# EAGLE design PCBFeeder_A_Board (EAGLE 8.4.3)
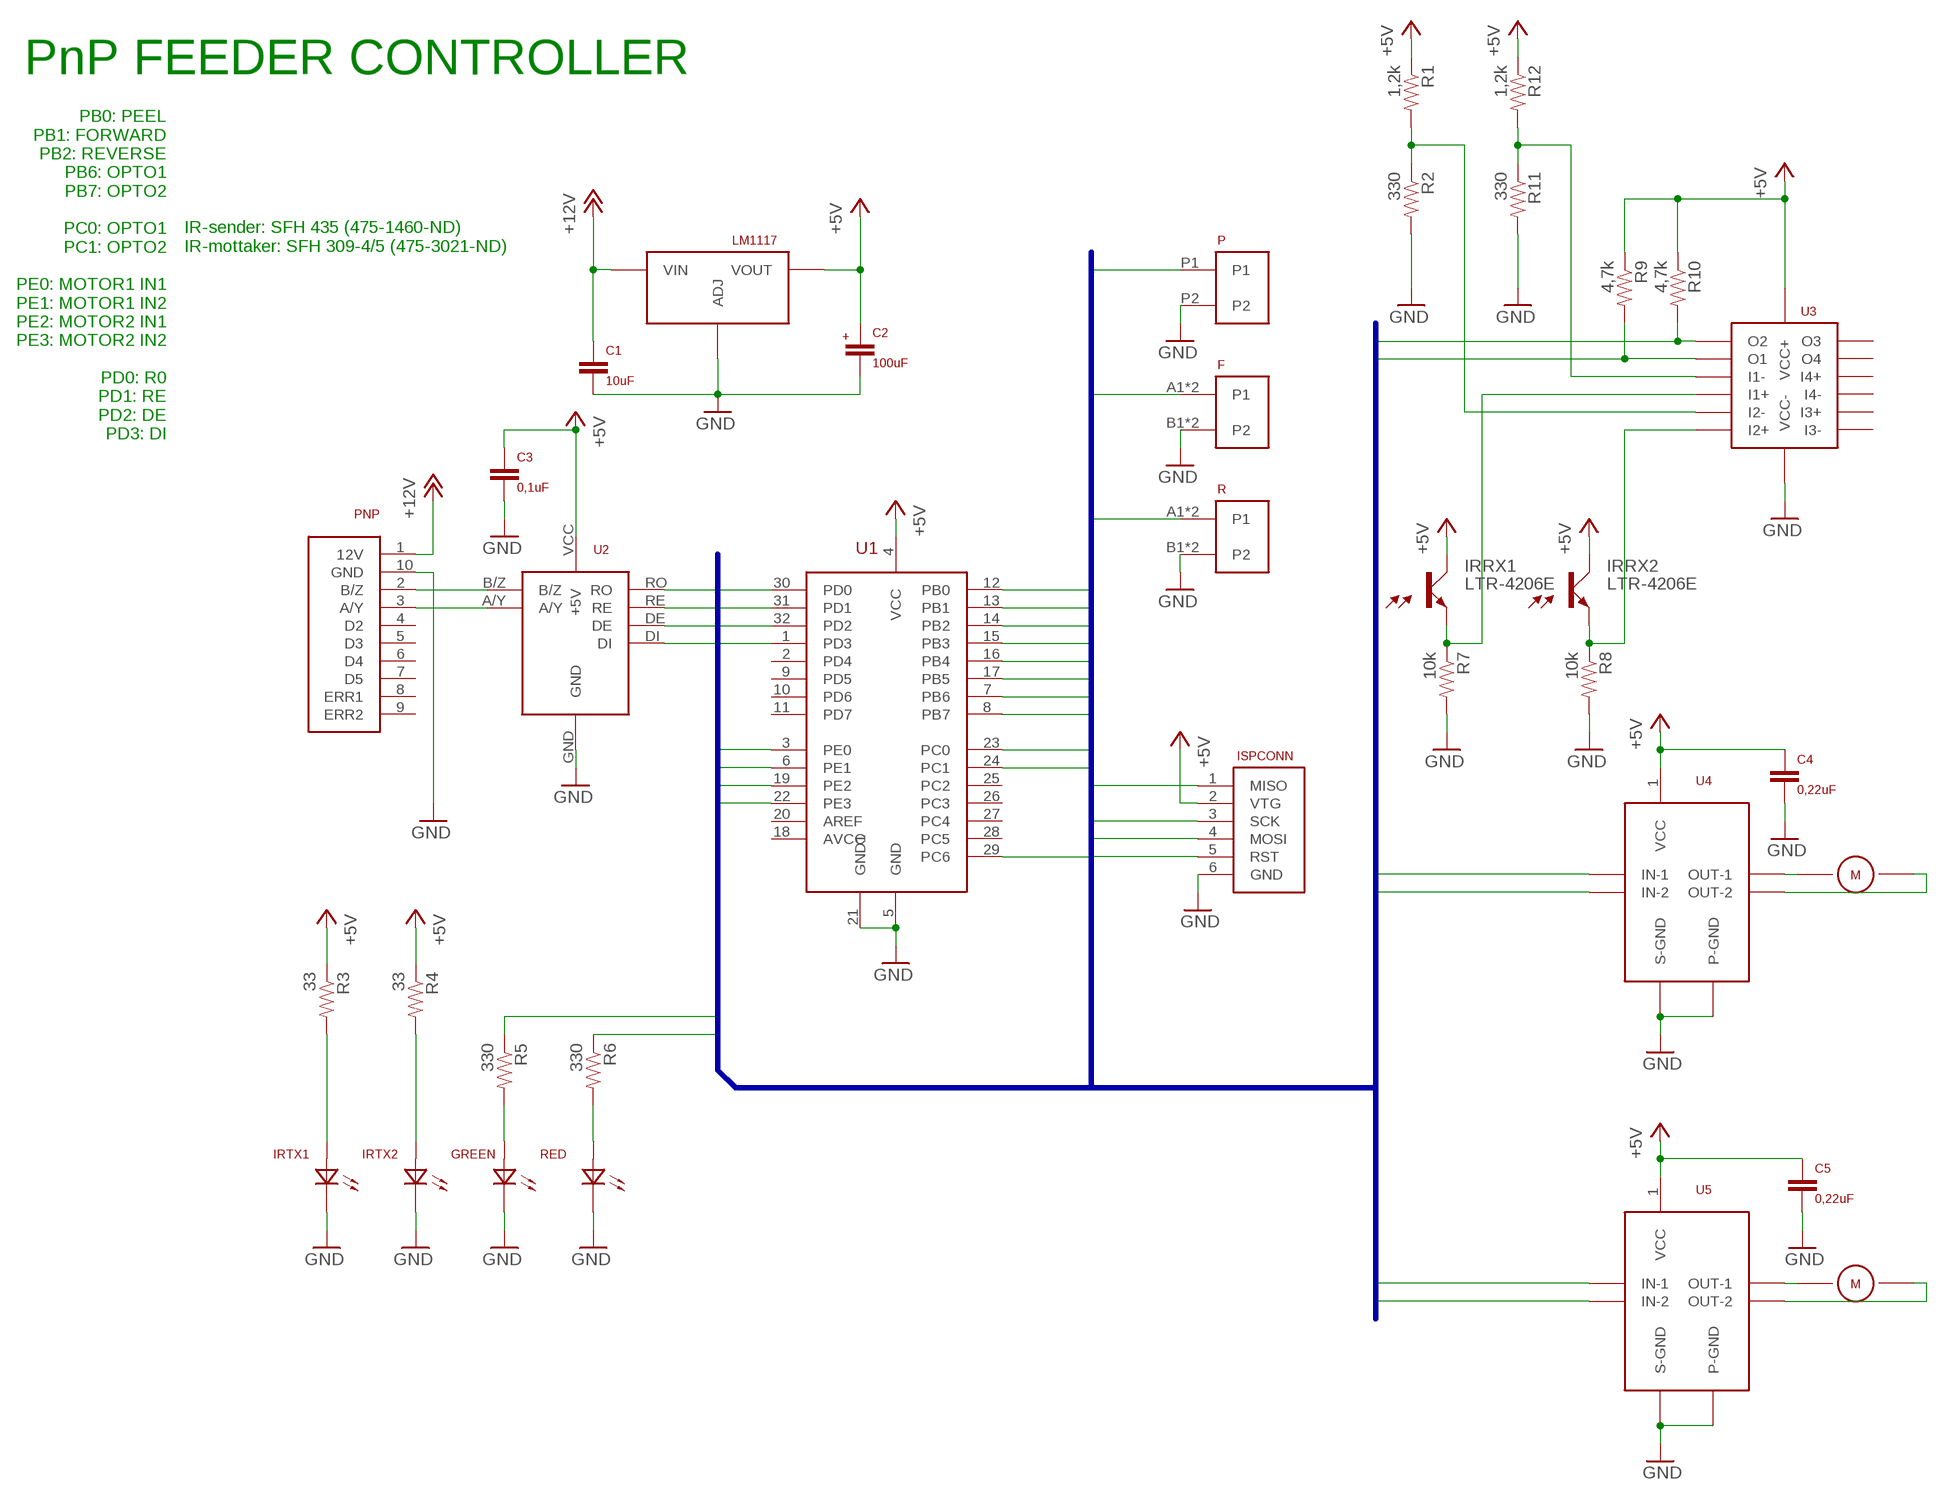
[diagram p0: schematic, sheet 1]

## Parts
C1  10uF  0.1UF-08050805  [0805]
C2  100uF  ELECTROLYTIC_CAPACITORWURTH_100  [ALUMINUM_WURTH_100UF_865080243007]
C3  0,1uF  0.1UF-08050805  [0805]
C4  0,22uF  0.22UF-08050805  [0805]
C5  0,22uF  0.22UF-08050805  [0805]
F  TERMINAL_2PSIDE_SWITCH  [SIDE-PUSH-SWITCH]
GREEN  LED  [LED_859_KTST_S220KSKT]
IRRX1  LTR-4206E  [DIODE_BREAKOUT]
IRRX2  LTR-4206E  [DIODE_BREAKOUT]
IRTX1  IR204C_IR_EMITTER  [IR_EMITTER_475-3009-1-ND]
IRTX2  IR204C_IR_EMITTER  [IR_EMITTER_475-3009-1-ND]
ISPCONN  ISP_PROG_HEADER  [IDC_HEADER_6P]
LM1117  LM1117  [SOT-223]
M1  MOTOR254  [SOLDER_CONNECTOR_2P_254]
M2  MOTOR254  [SOLDER_CONNECTOR_2P_254]
P  TERMINAL_2P254  [SOLDER_CONNECTOR_2P_254]
PNP  FEEDER_HEADER  [IDC_HEADER_VERTICAL_10P]
R  TERMINAL_2PSIDE_SWITCH  [SIDE-PUSH-SWITCH]
R1  1,2k  RESISTOR0805  [0805]
R2  330  RESISTOR0805  [0805]
R3  33  RESISTOR0805  [0805]
R4  33  RESISTOR0805  [0805]
R5  330  RESISTOR0805  [0805]
R6  330  RESISTOR0805  [0805]
R7  10k  RESISTOR0805  [0805]
R8  10k  RESISTOR0805  [0805]
R9  4,7k  RESISTOR0805  [0805]
R10  4,7k  RESISTOR0805  [0805]
R11  330  RESISTOR0805  [0805]
R12  1,2k  RESISTOR0805  [0805]
RED  LED  [LED_859_KTST_S220KSKT]
U1  MEGA168-AI  [TQFP32-08]
U2  ISL81487  ISL81487_RS485_TRANSCIEVER  [ISL81487_RS485_TRANSCIEVER]
U3  LM339  [TSSOP14]
U4  LB1930MC-AH-MOTOR-DRIVER  [SOIC-10]
U5  LB1930MC-AH-MOTOR-DRIVER  [SOIC-10]

## Nets
+5V: C2.+ C3.1 C4.1 C5.1 IRRX1.A IRRX2.A ISPCONN.2(VTG) LM1117.VOUT$1(VOUT) R1.1 R3.1 R4.1 R9.1 R10.1 R12.1 U1.4(VCC) U2.VCC(+5V) U3.P3(VCC+) U4.1(VCC) U5.1(VCC)
+12V: C1.1 LM1117.VIN PNP.1(12V)
DE: U1.32(PD2) U2.DE
DI: U1.1(PD3) U2.DI
FORWARD: F.A1(P1) F.A2(P1) U1.13(PB1)
GND: C1.2 C2.- C3.2 C4.2 C5.2 F.B1(P2) F.B2(P2) GREEN.C IRTX1.C IRTX2.C ISPCONN.6(GND) LM1117.GND(ADJ) P.P2 PNP.10(GND) R2.2 R7.2 R8.2 R11.2 R.B1(P2) R.B2(P2) RED.C U1.5(GND) U1.21(GND1) U2.GND U3.P12(VCC-) U4.5(S-GND) U4.6(P-GND) U5.5(S-GND) U5.6(P-GND)
LED_G: R5.1 U1.24(PC1)
LED_R: R6.1 U1.23(PC0)
M1_IN1: U1.3(PE0) U4.3(IN-1)
M1_IN2: U1.6(PE1) U4.4(IN-2)
M2_IN1: U1.19(PE2) U5.3(IN-1)
M2_IN2: U1.22(PE3) U5.4(IN-2)
MISO: ISPCONN.1(MISO) U1.16(PB4)
MOSI: ISPCONN.4(MOSI) U1.15(PB3)
N$1: PNP.2(B/Z) U2.B/Z
N$2: PNP.3(A/Y) U2.A/Y
N$3: IRRX1.C R7.1 U3.P5(I1+)
N$4: IRRX2.C R8.1 U3.P7(I2+)
N$5: R1.2 R2.1 U3.P6(I2-)
N$6: R11.1 R12.2 U3.P4(I1-)
N$11: M1.P1(A) U4.9(OUT-1)
N$12: M1.P2(B) U4.7(OUT-2)
N$13: M2.P1(A) U5.9(OUT-1)
N$14: M2.P2(B) U5.7(OUT-2)
N$15: IRTX1.A R3.2
N$16: IRTX2.A R4.2
N$17: GREEN.A R5.2
N$18: R6.2 RED.A
OPTO1: R9.2 U1.7(PB6) U3.P2(O1)
OPTO2: R10.2 U1.8(PB7) U3.P1(O2)
PEEL: P.P1 U1.12(PB0)
RE: U1.31(PD1) U2.RE
REVERSE: R.A1(P1) R.A2(P1) U1.14(PB2)
RO: U1.30(PD0) U2.RO
RST: ISPCONN.5(RST) U1.29(PC6)
SCK: ISPCONN.3(SCK) U1.17(PB5)
Unconnected: PNP.4(D2) PNP.5(D3) PNP.6(D4) PNP.7(D5) PNP.8(ERR1) PNP.9(ERR2) U1.2(PD4) U1.9(PD5) U1.10(PD6) U1.11(PD7) U1.18(AVCC) U1.20(AREF) U1.25(PC2) U1.26(PC3) U1.27(PC4) U1.28(PC5) U3.P8(I3-) U3.P9(I3+) U3.P10(I4-) U3.P11(I4+) U3.P13(O4) U3.P14(O3)

## Buses
RO,RE,DE,DI,MISO,SCK,MOSI,RST,PEEL,FORWARD,REVERSE,OPTO1,OPTO2,LED_R,LED_G,M1_IN1,M1_IN2,M2_IN1,M2_IN2

## Notes on the sheet
- PnP FEEDER CONTROLLER
- PB0: PEEL
  PB1: FORWARD
  PB2: REVERSE
  PB6: OPTO1
  PB7: OPTO2
  
  PC0: OPTO1
  PC1: OPTO2
  
  PE0: MOTOR1 IN1
  PE1: MOTOR1 IN2
  PE2: MOTOR2 IN1
  PE3: MOTOR2 IN2
  
  PD0: R0
  PD1: RE
  PD2: DE
  PD3: DI
- IR-sender: SFH 435 (475-1460-ND)
  IR-mottaker: SFH 309-4/5 (475-3021-ND)

## Library data of the parts
C1 = EE:0.1UF-0805; VALUE: 0,1uF
C2 = EE:ELECTROLYTIC_CAPACITOR
C3 = EE:0.1UF-0805
C4 C5 = EE:0.22UF-0805
F P R = EE:TERMINAL_2P
GREEN RED = EE:LED: LED-Anzeigeleuchte
IRRX1 IRRX2 = EE:LTR-4206E: Silicium NPN Phototransistor Source: Siemens; OC_FARNELL: unknown; OC_NEWARK: unknown
IRTX1 IRTX2 = EE:IR204C_IR_EMITTER
ISPCONN = EE:ISP_PROG_HEADER
LM1117 = EE:LM1117
M1 M2 = EE:MOTOR
PNP = EE:FEEDER_HEADER
R1-R12 = EE:RESISTOR
U1 = EE:MEGA168: MICROCONTROLLER 8 Kbytes FLASH, 1 kbytes SRAM, 512 bytes EEPROM, USART, 6-channel 10 bit ADC, 2-channel 8 bit ADC Pin compatible with Atmega48, ATMega88, ATMega168 Source: avr.lbr; MPN: ATMEGA8-16AU; OC_FARNELL: 9171371; OC_NEWARK: 73M8863
U2 = EE:ISL81487_RS485_TRANSCIEVER
U3 = EE:LM339
U4 U5 = EE:LB1930MC-AH-MOTOR-DRIVER

## Board
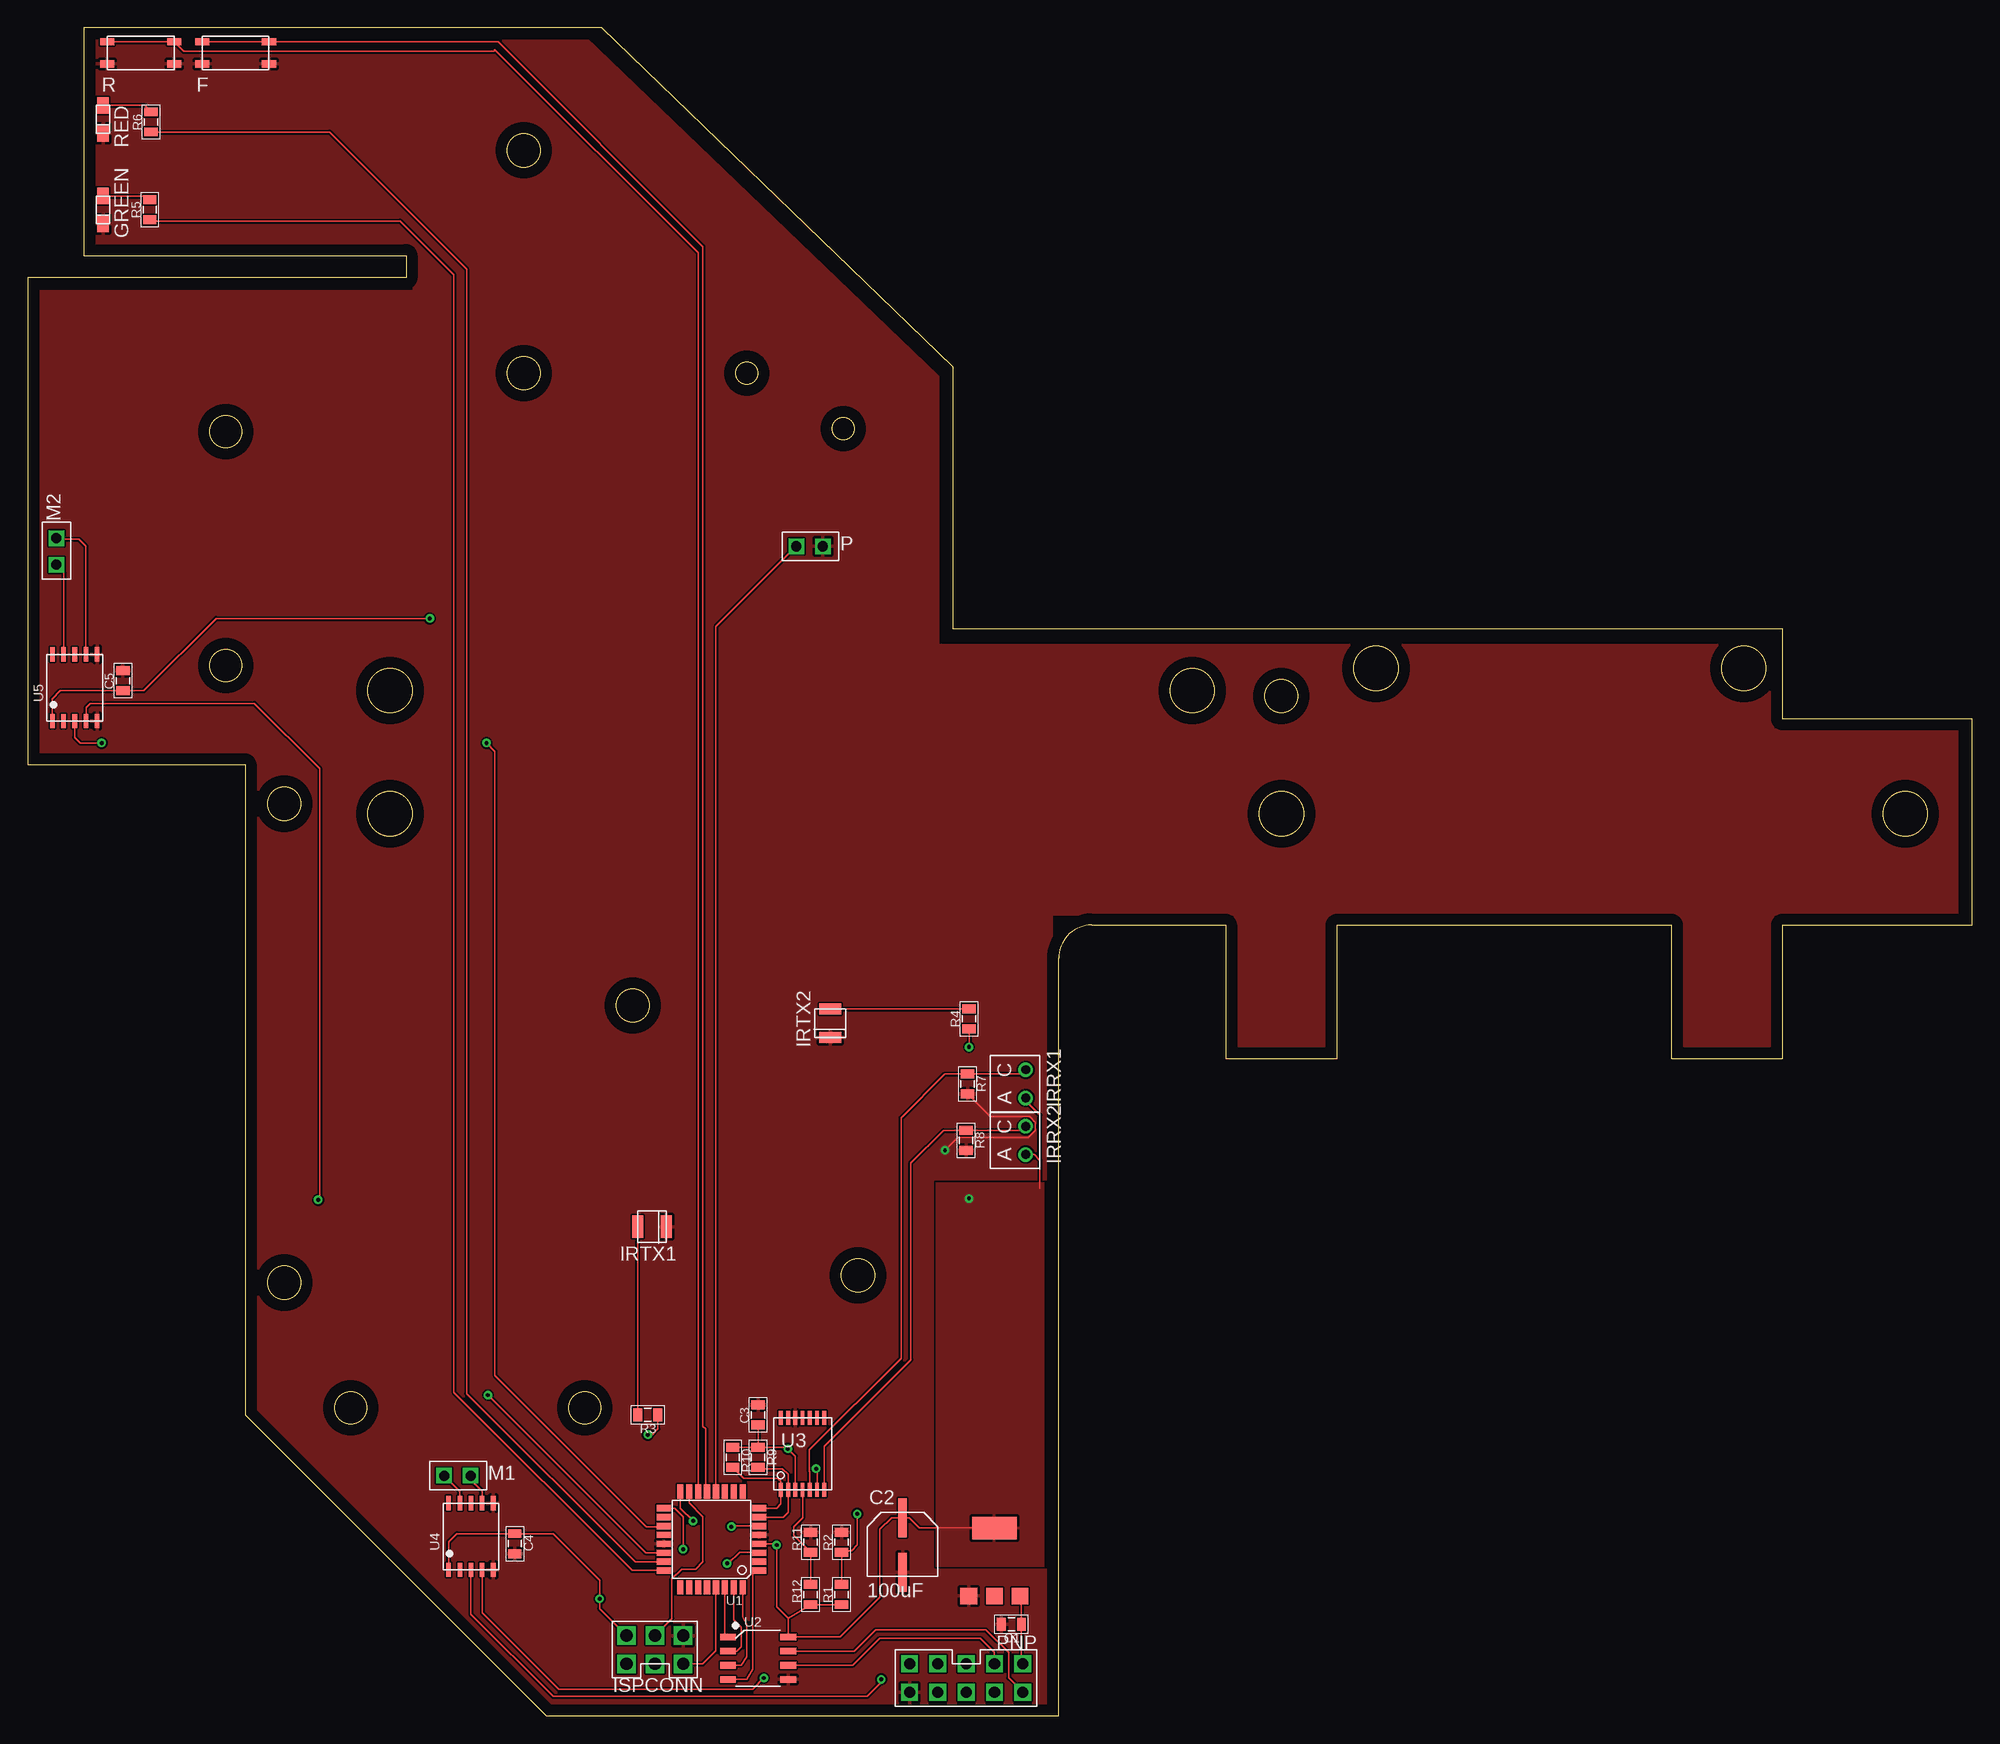
[diagram p1: board, top side]
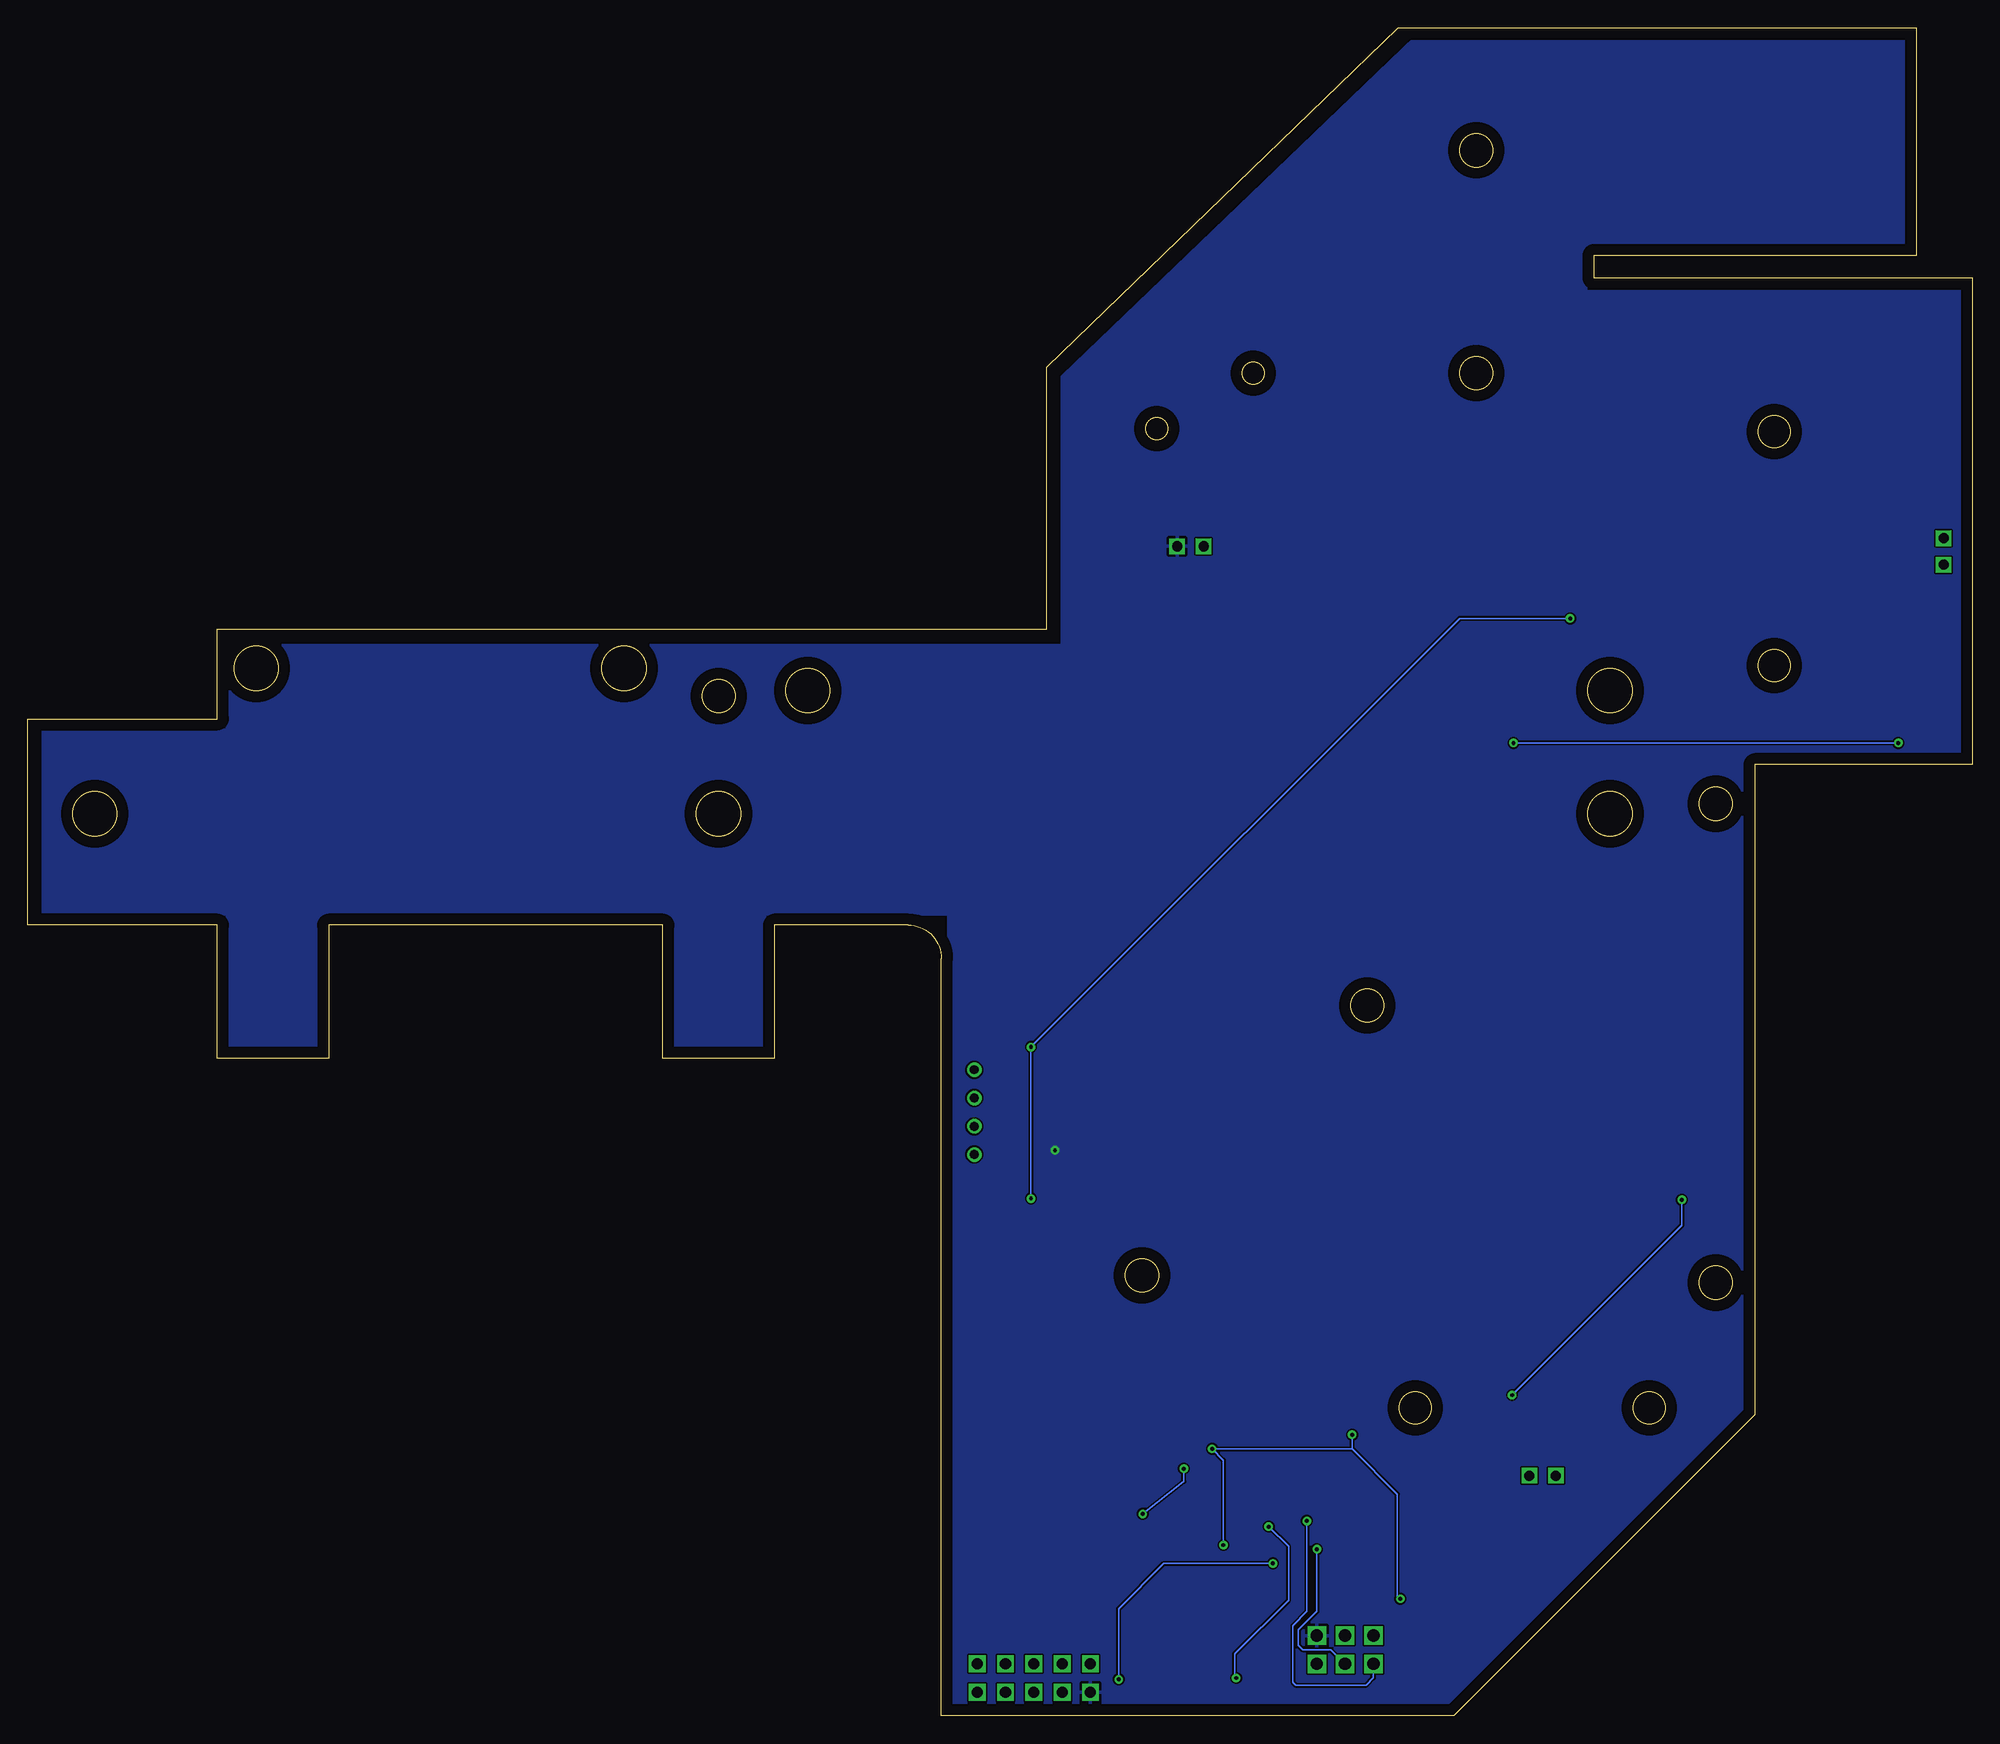
[diagram p2: board, bottom side, seen from below]

Size 174.51 x 151.55 mm. Coordinates in mm from the lower left corner, seen from the top.
Outline: 157.51,71 174.51,71 174.51,89.5 157.51,89.5 157.51,97.55 83.05,97.55 83.05,121.08 51.51,151.55 5,151.55 5,131.1 33.96,131.1 33.96,129.1 0,129.1 0,85.39 19.51,85.39 19.51,27 46.51,0 92.51,0 92.51,68 arc-90 95.51,71 107.51,71 107.51,59 117.51,59 117.51,71 147.51,71 147.51,59 157.51,59 157.51,71
Outline: circle at 168.51,81 radius 2
Outline: circle at 17.75,115.3 radius 1.45
Outline: circle at 17.75,94.3 radius 1.45
Outline: circle at 44.51,140.55 radius 1.5
Outline: circle at 44.51,120.55 radius 1.5
Outline: circle at 54.29,63.79 radius 1.5
Outline: circle at 74.51,39.55 radius 1.5
Outline: circle at 23.01,38.89 radius 1.5
Outline: circle at 23.01,81.89 radius 1.5
Outline: circle at 64.51,120.55 radius 1
Outline: circle at 73.18,115.57 radius 1
Outline: circle at 112.51,91.55 radius 1.5
Outline: circle at 29,27.65 radius 1.45
Outline: circle at 50,27.65 radius 1.45
Outline: circle at 121.01,94.05 radius 2
Outline: circle at 154.01,94.05 radius 2
Outline: circle at 112.51,81 radius 2
Outline: circle at 32.51,81 radius 2
Outline: circle at 104.51,92.05 radius 2
Outline: circle at 32.51,92.05 radius 2
Copper layers (1*16): Top 0.035mm / dielectric 1.5mm / Bottom 0.035mm
Design rules "default": minimum track width 6mil, minimum drill 0.35mm, track to track 6mil, track to pad 6mil, pad to pad 6mil, via to via 6mil, smd to smd 6mil, copper to edge 40mil, drill to drill 6mil, minimum pad ring 10mil, minimum via ring 8mil, stop-mask expansion 4mil, vias tented up to drill 0mil, thermal gap 10mil

### Footprints (pad centres in the part's own frame; a part is rotated, then mirrored left to right if it is on the bottom)
0805 = smd 0.8 x 1.2: 1 -0.9,0; 2 0.9,0
ALUMINUM_WURTH_100UF_865080243007 = smd 0.8 x 3.5: + 0,0.8; - 0,-4.1
SIDE-PUSH-SWITCH = smd 1.27 x 0.635: A1 0,2; A2 6,2; B1 0,0; B2 6,0
LED_859_KTST_S220KSKT = smd 1 x 1.5: A 0,2.5; C 0,0
DIODE_BREAKOUT = drill 0.8 pad 1.3: A 2.54,2.54; C 0,2.54
IR_EMITTER_475-3009-1-ND = smd 1 x 2: A 0,0; C 2.552,0
IDC_HEADER_6P = drill 1.1 square: 1 0,-2.54; 2 0,0; 3 2.54,-2.54; 4 2.54,0; 5 5.08,-2.54; 6 5.08,0
SOT-223 = smd 1.5 x 1.5: GND -2.3,-6.1; P$2 0,-6.1; VIN 2.3,-6.1 | smd 4 x 2: VOUT$1 0,0
SOLDER_CONNECTOR_2P_254 = drill 0.9 square: P1 0,0; P2 2.38,0
IDC_HEADER_VERTICAL_10P = drill 1 square: 1 0,-2.54; 2 0,0; 3 2.54,-2.54; 4 2.54,0; 5 5.08,-2.54; 6 5.08,0; 7 7.62,-2.54; 8 7.62,0; 9 10.16,-2.54; 10 10.16,0
TQFP32-08 = smd 1.27 x 0.559: 1 -4.293,2.8; 2 -4.293,2; 3 -4.293,1.2; 4 -4.293,0.4; 5 -4.293,-0.4; 6 -4.293,-1.2; 7 -4.293,-2; 8 -4.293,-2.8; 17 4.293,-2.8; 18 4.293,-2; 19 4.293,-1.2; 20 4.293,-0.4; 21 4.293,0.4; 22 4.293,1.2; 23 4.293,2; 24 4.293,2.8 | smd 0.559 x 1.27: 9 -2.8,-4.293; 10 -2,-4.293; 11 -1.2,-4.293; 12 -0.4,-4.293; 13 0.4,-4.293; 14 1.2,-4.293; 15 2,-4.293; 16 2.8,-4.293; 25 2.8,4.293; 26 2,4.293; 27 1.2,4.293; 28 0.4,4.293; 29 -0.4,4.293; 30 -1.2,4.293; 31 -2,4.293; 32 -2.8,4.293
ISL81487_RS485_TRANSCIEVER = smd 0.6 x 1.4: A/Y 0.635,2.7; B/Z -0.635,2.7; DE 0.635,-2.7; DI 1.905,-2.7; GND 1.905,2.7; RE -0.635,-2.7; RO -1.905,-2.7; VCC -1.905,2.7
TSSOP14 = smd 0.35 x 1.27: P1 0,0; P2 0.65,0; P3 1.3,0; P4 1.95,0; P5 2.6,0; P6 3.25,0; P7 3.9,0; P8 3.9,6.47; P9 3.25,6.47; P10 2.6,6.47; P11 1.95,6.47; P12 1.3,6.47; P13 0.65,6.47; P14 0,6.47
SOIC-10 = smd 0.41 x 1.27: 1 -2,-3; 2 -1,-3; 3 0,-3; 4 1,-3; 5 2,-3; 6 2,3; 7 1,3; 8 0,3; 9 -1,3; 10 -2,3

### Placement (x,y rotation side)
C1  88.28,8.22 180 top
C2  78.5,16.99 0 top
C3  65.55,27.02 90 top
C4  43.71,15.46 270 top
C5  8.53,92.93 90 top
F  15.64,148.3 0 top
GREEN  6.75,133.95 0 top
IRRX1  87.01,58.01 270 top
IRRX2  87.01,52.93 270 top
IRTX1  54.76,43.91 0 top
IRTX2  72.03,63.47 270 top
ISPCONN  53.74,7.21 0 top
LM1117  86.76,16.86 0 top
M1  37.36,21.56 0 top
M2  2.56,103.35 90 top
P  68.98,105 0 top
PNP  89.3,2.13 180 top
R  7.13,148.3 0 top
R1  73.04,10.89 90 top
R2  73.04,15.59 90 top
R3  55.64,27.02 180 top
R4  84.47,62.58 90 top
R5  10.94,135.22 90 top
R6  11.07,143.1 90 top
R7  84.35,56.74 270 top
R8  84.22,51.66 270 top
R9  65.55,23.21 270 top
R10  63.26,23.21 270 top
R11  70.25,15.59 90 top
R12  70.25,10.89 90 top
RED  6.75,142.08 0 top
U1  61.36,15.84 180 top
U2  65.55,5.18 270 top
U3  67.58,20.29 0 top
U4  39.77,16.1 0 top
U5  4.21,92.3 0 top

### Tracks (layer width: path | path; a pad name or v marks a point on that pad's centre or on a via)
+5V  (via drill 0.35)
  Top 0.152: U4.1 37.77,15.62 38.51,16.36 C4.1 47.14,16.35 51.33,12.16 v51.33,10.51 51.33,9.62 ISPCONN.2 | U3.P3 68.88,23.31 v68.22,23.97 68.08,24.11 R9.1 | U5.1 2.18,89.33 2.18,91.28 2.93,92.03 C5.1 10.42,92.03 16.91,98.52 v36.09,98.52 | v55.64,25.24 56.03,25.24 56.54,25.76 R3.1 | LM1117.VOUT$1 80.03,16.86 79.1,17.79 C2.+ 77.53,17.79 76.47,16.73 76.47,10.64 72.92,7.08 U2.VCC 68.25,8.75 | R10.1 R9.1 | C3.1 R9.1 | R1.1 R12.1 68.25,8.75 | U1.4 67.09,15.44 v67.2,15.34 67.2,9.8 68.25,8.75 | IRRX1.A 89.55,55.21 90.82,53.94 90.82,49.88 | 90.82,49.88 90.82,47.34 | IRRX2.A 90.32,50.39 90.82,49.88 | R4.1 v84.47,60.04
  Bottom 0.152: v51.33,10.51 51.58,10.76 51.58,19.91 55.64,23.97 | 55.64,23.97 v68.22,23.97 67.2,22.96 v67.2,15.34 | 55.64,23.97 v55.64,25.24 | v84.47,46.45 v84.47,60.04 45.99,98.52 v36.09,98.52
  pour Top (isolate 1.27): 81.55,13.43 81.55,47.85 91.71,47.85 91.71,13.43
+12V
  Top 0.152: LM1117.VIN 89.18,10.64 C1.1 89.18,4.78 PNP.1
DE
  Top 0.152: U1.32 64.16,8.85 64.53,8.22 64.53,5.3 64.03,4.54 U2.DE
DI
  Top 0.152: U2.DI 64.53,3.27 65.04,4.16 65.04,12.81 U1.1
FORWARD
  Top 0.152: F.A1 F.A2 42.21,150.3 60.6,131.92 60.6,26 60.85,25.75 60.85,20.24 U1.13
GND  (via drill 0.35)
  Top 0.152: v82.31,50.77 83.47,51.93 89.8,51.93 90.44,52.56 90.44,53.29 89.92,53.81 86.37,53.81 R7.2
  pour Bottom: 0.4,127.86 0.4,85.95 19.45,85.95 19.45,27.53 46.12,0.86 91.84,0.86 91.84,71.98 108.35,71.98 108.35,59.28 117.24,59.28 117.24,71.98 147.72,71.98 147.72,59.28 156.61,59.28 156.61,71.98 173.12,71.98 173.12,88.49 156.61,88.49 156.61,96.11 81.68,96.11 81.68,120.24 49.93,150.72 5.48,150.72 5.48,131.67 34.69,131.67 34.69,127.86
  pour Top (rank 2): 0.4,127.86 0.4,85.95 19.45,85.95 19.45,27.53 46.12,0.86 91.84,0.86 91.84,71.98 108.35,71.98 108.35,59.28 117.24,59.28 117.24,71.98 147.72,71.98 147.72,59.28 156.61,59.28 156.61,71.98 173.12,71.98 173.12,88.49 156.61,88.49 156.61,96.11 81.68,96.11 81.68,120.24 49.93,150.72 5.48,150.72 5.48,131.67 34.69,131.67 34.69,127.86
LED_G
  Top 0.152: R5.1 11.06,134.21 33.42,134.21 38.25,129.38 38.25,29.05 54.25,13.05 U1.24
LED_R
  Top 0.152: R6.1 27.08,142.2 39.39,129.89 39.39,28.92 54.5,13.81 57.03,13.81 U1.23
M1_IN1  (via drill 0.35)
  Top 0.152: U4.3 39.77,9.11 47.14,1.75 75.33,1.75 76.6,3.02 v76.6,3.27 | v62.76,13.68 62.88,13.68 63.9,14.7 65.6,14.7 U1.3
  Bottom 0.152: v76.6,3.27 76.6,9.62 72.54,13.68 v62.76,13.68
M1_IN2  (via drill 0.35)
  Top 0.152: U4.4 40.79,13.08 40.79,9.24 47.64,2.38 65.04,2.38 v66.06,3.4 | v63.14,16.99 63.19,17.04 U1.6
  Bottom 0.152: v66.06,3.4 66.19,3.52 66.19,5.56 61.36,10.38 61.36,15.21 v63.14,16.99
M2_IN1  (via drill 0.35)
  Top 0.152: U5.3 4.21,87.85 4.72,87.34 v6.62,87.34 | v41.17,87.34 41.93,86.58 41.93,30.58 55.52,16.99 57.01,16.99 U1.19
  Bottom 0.152: v6.62,87.34 v41.17,87.34
M2_IN2  (via drill 0.35)
  Top 0.152: U5.4 5.23,89.31 5.23,90.52 5.61,90.9 20.34,90.9 26.18,85.06 26.18,46.45 v26.05,46.32 | v41.29,28.8 55.45,14.64 U1.22
  Bottom 0.152: v26.05,46.32 26.05,44.04 v41.29,28.8
MISO  (via drill 0.35)
  Top 0.152: U1.16 58.56,18.64 v59.71,17.49
  Bottom 0.152: v59.71,17.49 59.71,9.37 60.98,8.1 60.98,3.02 60.72,2.76 54.37,2.76 53.74,3.4 ISPCONN.1
MOSI
  Top 0.152: ISPCONN.4 57.8,8.73 57.8,12.29 58.69,13.18 59.96,13.18 60.6,13.81 60.6,17.88 59.36,19.11 U1.15
N$1
  Top 0.152: U2.B/Z 74.19,5.81 76.09,7.72 86,7.72 88.03,5.68 88.03,3.4 PNP.2
N$2
  Top 0.152: PNP.3 86.76,5.68 85.49,6.95 76.47,6.95 74.06,4.54 U2.A/Y
N$3
  Top 0.152: IRRX1.C 89.18,57.64 R7.1 84.34,57.63 82.31,57.63 78.38,53.69 78.38,32.1 70.15,23.87 70.15,21.94 70.18,21.91 U3.P5
N$4
  Top 0.152: IRRX2.C 89.18,52.56 R8.1 84.21,52.55 82.19,52.55 79.27,49.63 79.27,31.97 71.48,24.19 U3.P7
N$5  (via drill 0.35)
  Top 0.152: R1.2 R2.1 72.8,14.83 73.93,14.83 74.44,15.34 v74.44,18.13 | v70.76,22.19 70.83,22.12 U3.P6
  Bottom 0.152: v74.44,18.13 70.76,21.05 v70.76,22.19
N$6
  Top 0.152: R12.2 R11.1 68.73,16.21 68.73,16.99 69.53,17.79 U3.P4
N$11
  Top 0.152: U4.9 38.77,20.15 M1.P1
N$12
  Top 0.152: M1.P2 39.74,21.21 40.79,20.16 40.79,19.11 U4.7
N$13
  Top 0.152: M2.P1 3.21,102.7 U5.9
N$14
  Top 0.152: M2.P2 2.65,105.63 4.59,105.63 5.21,105.01 U5.7
N$15
  Top 0.152: R3.2 54.74,43.9 IRTX1.A
N$16
  Top 0.152: IRTX2.A R4.2
N$17
  Top 0.152: GREEN.A 10.61,136.45 R5.2
N$18
  Top 0.152: RED.A 10.48,144.58 R6.2
OPTO1
  Top 0.152: U1.7 67.8,17.84 68.23,18.27 U3.P2 68.23,21.67 67.71,22.19 65.67,22.19 R9.2
OPTO2
  Top 0.152: U1.8 67.2,18.64 67.58,19.02 U3.P1 67.58,21.05 67.33,21.3 64.27,21.3 R10.2
PEEL
  Top 0.152: P.P1 61.76,97.78 U1.12
RE
  Top 0.152: U1.31 63.36,8.64 64.03,7.97 64.03,6.19 63.65,5.81 U2.RE
REVERSE
  Top 0.152: R.A1 R.A2 13.99,149.45 41.8,149.45 41.93,149.57 60.16,131.34 U1.14
RO
  Top 0.152: U1.30 62.56,7.37 U2.RO
RST
  Top 0.152: ISPCONN.5 60.6,4.67 61.76,5.83 U1.29
SCK  (via drill 0.35)
  Top 0.152: U1.17 58.06,18.64 58.82,17.88 v58.82,14.95
  Bottom 0.152: v58.82,14.95 58.82,9.37 60.47,7.72 60.47,6.32 60.09,5.94 57.55,5.94 ISPCONN.3